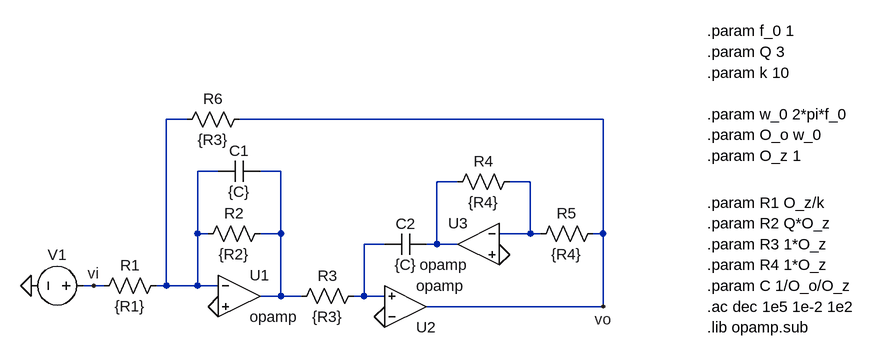
[diagram p0: schematic circ.asc]
circ.asc, the LTspice schematic file:
Version 4
SHEET 1 1260 680
WIRE 16 160 -16 160
WIRE 656 160 96 160
WIRE 64 240 32 240
WIRE 160 240 128 240
WIRE 432 256 400 256
WIRE 544 256 512 256
WIRE 32 336 32 240
WIRE 48 336 32 336
WIRE 160 336 160 240
WIRE 160 336 128 336
WIRE 544 336 544 256
WIRE 544 336 496 336
WIRE 560 336 544 336
WIRE 656 336 656 160
WIRE 656 336 640 336
WIRE 320 352 288 352
WIRE 400 352 400 256
WIRE 400 352 384 352
WIRE 432 352 400 352
WIRE -128 416 -144 416
WIRE -112 416 -128 416
WIRE -16 416 -16 160
WIRE -16 416 -32 416
WIRE 32 416 32 336
WIRE 32 416 -16 416
WIRE 64 416 32 416
WIRE 160 432 160 336
WIRE 160 432 128 432
WIRE 192 432 160 432
WIRE 288 432 288 352
WIRE 288 432 272 432
WIRE 320 432 288 432
WIRE 656 448 656 336
WIRE 656 448 384 448
FLAG 64 448 0
FLAG 320 464 0
FLAG 496 368 0
FLAG -128 416 vi
FLAG 656 448 vo
FLAG -224 416 0
SYMBOL opamp 96 368 R0
SYMATTR InstName U1
SYMBOL opamp 352 512 M180
SYMATTR InstName U2
SYMBOL opamp 464 288 M0
SYMATTR InstName U3
SYMBOL res -16 400 R90
WINDOW 0 0 56 VBottom 2
WINDOW 3 32 56 VTop 2
SYMATTR InstName R1
SYMATTR Value {R1}
SYMBOL res 144 320 R90
WINDOW 0 0 56 VBottom 2
WINDOW 3 32 56 VTop 2
SYMATTR InstName R2
SYMATTR Value {R2}
SYMBOL res 288 416 R90
WINDOW 0 0 56 VBottom 2
WINDOW 3 32 56 VTop 2
SYMATTR InstName R3
SYMATTR Value {R3}
SYMBOL res 528 240 R90
WINDOW 0 0 56 VBottom 2
WINDOW 3 32 56 VTop 2
SYMATTR InstName R4
SYMATTR Value {R4}
SYMBOL res 656 320 R90
WINDOW 0 0 56 VBottom 2
WINDOW 3 32 56 VTop 2
SYMATTR InstName R5
SYMATTR Value {R4}
SYMBOL res 112 144 R90
WINDOW 0 0 56 VBottom 2
WINDOW 3 32 56 VTop 2
SYMATTR InstName R6
SYMATTR Value {R3}
SYMBOL cap 128 224 R90
WINDOW 0 0 32 VBottom 2
WINDOW 3 32 32 VTop 2
SYMATTR InstName C1
SYMATTR Value {C}
SYMBOL cap 384 336 R90
WINDOW 0 0 32 VBottom 2
WINDOW 3 32 32 VTop 2
SYMATTR InstName C2
SYMATTR Value {C}
SYMBOL voltage -128 416 R90
WINDOW 0 -32 56 VBottom 2
WINDOW 3 32 56 VTop 2
SYMATTR InstName V1
SYMATTR Value ""
SYMATTR Value2 AC 1
TEXT 816 288 Left 2 !.param R1 O_z/k
TEXT 816 320 Left 2 !.param R2 Q*O_z
TEXT 816 352 Left 2 !.param R3 1*O_z
TEXT 816 384 Left 2 !.param R4 1*O_z
TEXT 816 416 Left 2 !.param C 1/O_o/O_z
TEXT 816 448 Left 2 !.ac dec 1e5 1e-2 1e2
TEXT 816 480 Left 2 !.lib opamp.sub
TEXT 816 184 Left 2 !.param O_o w_0
TEXT 816 216 Left 2 !.param O_z 1
TEXT 816 24 Left 2 !.param f_0 1
TEXT 816 56 Left 2 !.param Q 3
TEXT 816 152 Left 2 !.param w_0 2*pi*f_0
TEXT 816 88 Left 2 !.param k 10

The netlist it stands for:
* circ.asc
XU1 N001 0 N002 opamp Aol=100K GBW=10Meg  ; pins invin noninvin out
XU2 0 N005 vo opamp Aol=100K GBW=10Meg  ; pins invin noninvin out
XU3 N004 0 N003 opamp Aol=100K GBW=10Meg  ; pins invin noninvin out
R1 N001 vi {R1}
R2 N002 N001 {R2}
R3 N005 N002 {R3}
R4 N004 N003 {R4}
R5 vo N004 {R4}
R6 vo N001 {R3}
C1 N002 N001 {C}
C2 N003 N005 {C}
V1 vi 0 AC 1
.param R1 O_z/k
.param R2 Q*O_z
.param R3 1*O_z
.param R4 1*O_z
.param C 1/O_o/O_z
.ac dec 1e5 1e-2 1e2
.lib opamp.sub
.param O_o w_0
.param O_z 1
.param f_0 1
.param Q 3
.param w_0 2*pi*f_0
.param k 10
.backanno
.end